# EAGLE schematic systems-controller (EAGLE 7.6.0)

## Sheet 1 of 4: Power Supply
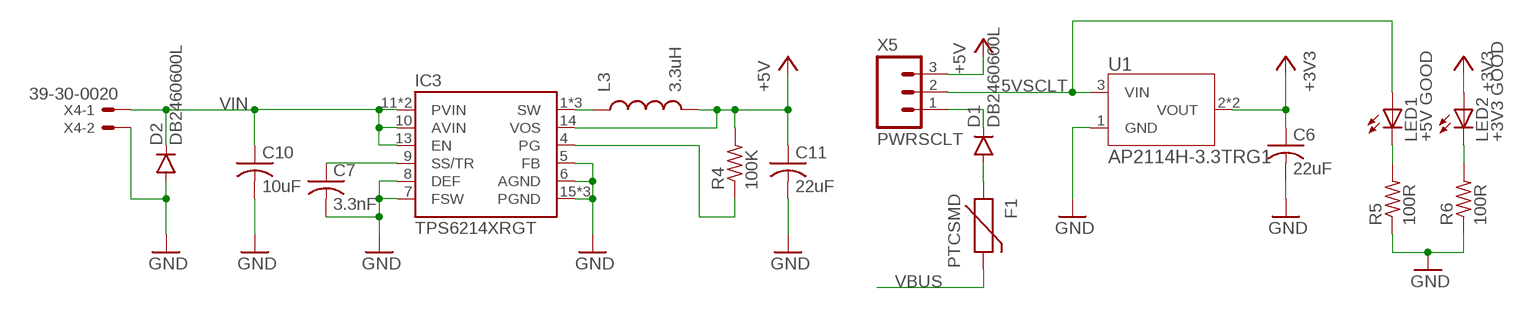
[diagram p0: schematic, sheet 1]

### Parts
C6  22uF  C-USC0805K  [C0805K]
C7  3.3nF  C-USC0603K  [C0603K]
C10  10uF  C-USC0805K  [C0805K]
C11  22uF  C-USC0805K  [C0805K]
D1  DB2460600L  DIODESOD128  [SOD-128]
D2  DB2460600L  DIODESOD128  [SOD-128]
F1  PTCSMD  [PTC-1206]
IC3  TPS6214XRGT  [16-VQFN]
L3  3.3uH  INDUCTOR-SRN5020  [SRN5020]
LED1  +5V GOOD  LEDSML0603  [SML0603]
LED2  +3V3 GOOD  LEDSML0603  [SML0603]
R4  100K  R-US_R0603  [R0603]
R5  100R  R-US_R0603  [R0603]
R6  100R  R-US_R0603  [R0603]
U1  AP2114H-3.3TRG1  [SOT-223]
X4  39-30-0020  [39-30-0020]
X5  PWRSCLT  M03PTH  [1X03]

### Nets
5VSCLT: LED1.A U1.3(VIN) X5.2
+3V3: C6.1 LED2.A U1.2(VOUT) U1.4(VOUT) ; also sheet 2
+5V: C11.1 IC3.14(VOS) L3.2 R4.2 X5.3 ; also sheet 3
GND: C6.2 C7.2 C10.2 C11.2 D2.A IC3.5(FB) IC3.6(AGND) IC3.7(FSW) IC3.8(DEF) IC3.15(PGND) IC3.16(PGND) IC3.PAD(PGND) R5.1 R6.1 U1.1(GND) X4.2 ; also sheet 2,3,4
N$13: IC3.4(PG) R4.1
N$14: C7.1 IC3.9(SS/TR)
N$16: D1.C X5.1
N$17: IC3.1(SW) IC3.2(SW) IC3.3(SW) L3.1
N$20: D1.A F1.1
N$23: LED1.C R5.2
N$24: LED2.C R6.2
VBUS: F1.2 ; also sheet 2
VIN: C10.1 D2.C IC3.10(AVIN) IC3.11(PVIN) IC3.12(PVIN) IC3.13(EN) X4.1 ; also sheet 3

## Sheet 2 of 4: Microcontroller
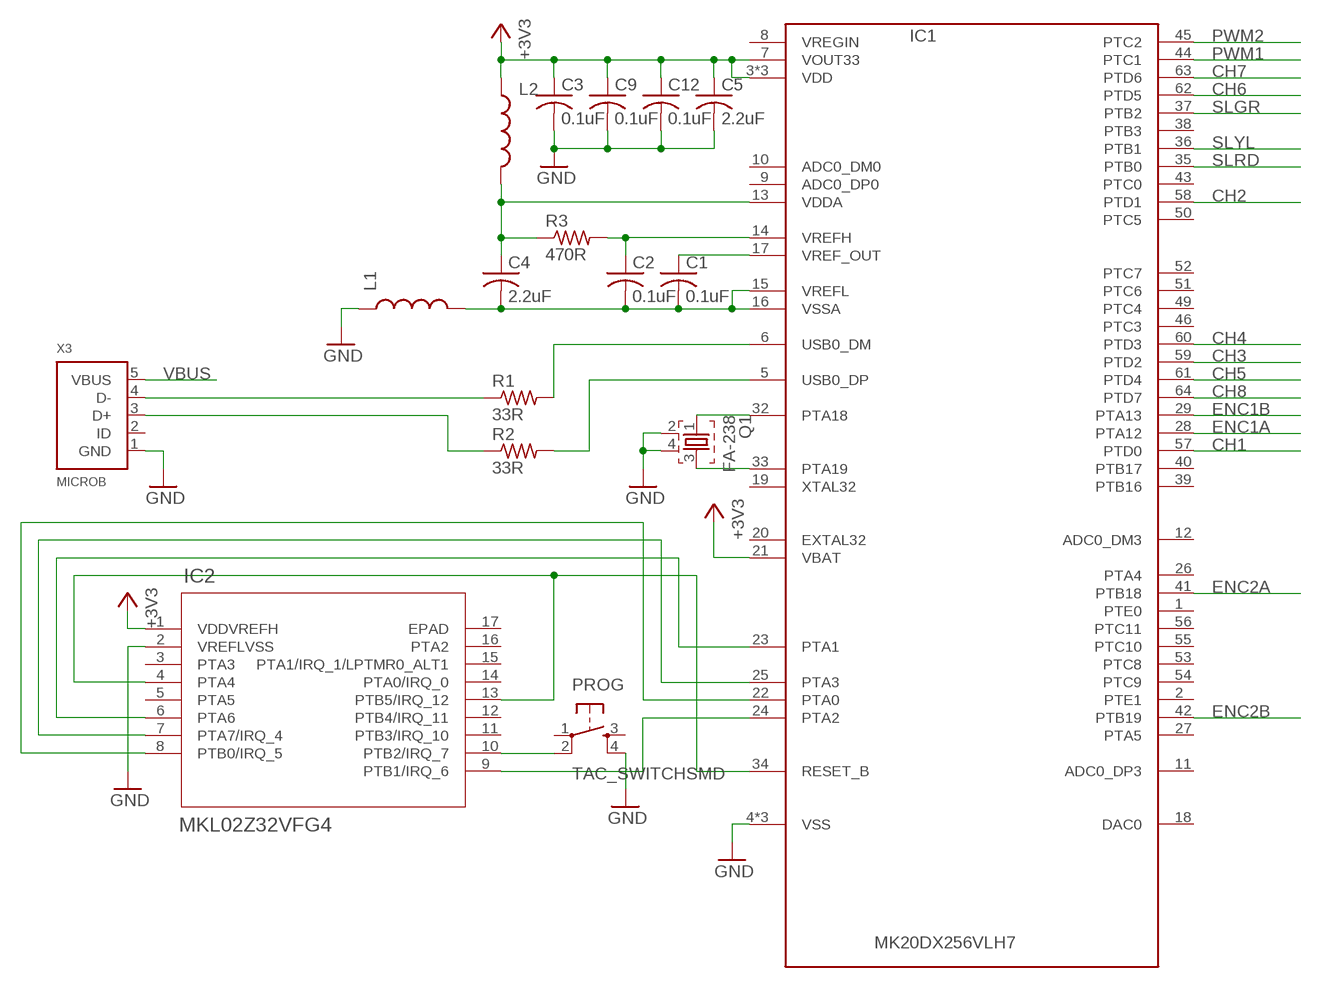
[diagram p1: schematic, sheet 2]

### Parts
C1  0.1uF  C-USC0603K  [C0603K]
C2  0.1uF  C-USC0603K  [C0603K]
C3  0.1uF  C-USC0603K  [C0603K]
C4  2.2uF  C-USC0603K  [C0603K]
C5  2.2uF  C-USC0603K  [C0603K]
C9  0.1uF  C-USC0603K  [C0603K]
C12  0.1uF  C-USC0603K  [C0603K]
IC1  MK20DX256VLH7  [MK20DX256VLH7]
IC2  MKL02Z32VFG4  [QFN-16_3X3X0.65]
L1  INDUCTOR30OHM,1.8A  [0603]
L2  INDUCTOR30OHM,1.8A  [0603]
PROG  TAC_SWITCHSMD  [TACTILE-SWITCH-SMD]
Q1  FA-238  [FA-238]
R1  33R  R-US_R0603  [R0603]
R2  33R  R-US_R0603  [R0603]
R3  470R  R-US_R0603  [R0603]
X3  MICROB  [10118192]

### Nets
+3V3: C3.1 C5.1 C9.1 C12.1 IC1.3(VDD) IC1.7(VOUT33) IC1.21(VBAT) IC1.30(VDD) IC1.48(VDD) IC2.1(VDDVREFH) L2.1 ; also sheet 1
CH1: IC1.57(PTD0) ; also sheet 3
CH2: IC1.58(PTD1) ; also sheet 3
CH3: IC1.59(PTD2) ; also sheet 3
CH4: IC1.60(PTD3) ; also sheet 3
CH5: IC1.61(PTD4) ; also sheet 3
CH6: IC1.62(PTD5) ; also sheet 3
CH7: IC1.63(PTD6) ; also sheet 3
CH8: IC1.64(PTD7) ; also sheet 3
ENC1A: IC1.28(PTA12) ; also sheet 3
ENC1B: IC1.29(PTA13) ; also sheet 3
ENC2A: IC1.41(PTB18) ; also sheet 3
ENC2B: IC1.42(PTB19) ; also sheet 3
GND: C3.2 C5.2 C9.2 C12.2 IC1.4(VSS) IC1.31(VSS) IC1.47(VSS) IC2.2(VREFLVSS) L1.1 PROG.4 Q1.2 Q1.4 X3.1(GND) ; also sheet 1,3,4
N$1: IC1.25(PTA3) IC2.7(PTA7/IRQ_4)
N$2: IC1.22(PTA0) IC2.8(PTB0/IRQ_5)
N$3: IC1.24(PTA2) IC2.9(PTB1/IRQ_6)
N$4: IC1.23(PTA1) IC2.6(PTA6)
N$5: IC1.34(RESET_B) IC2.4(PTA4) IC2.13(PTB5/IRQ_12)
N$6: R1.1 X3.4(D-)
N$7: IC1.6(USB0_DM) R1.2
N$8: R2.1 X3.3(D+)
N$9: IC1.5(USB0_DP) R2.2
N$10: IC1.32(PTA18) Q1.1
N$11: IC1.33(PTA19) Q1.3
N$12: C1.2 C2.2 C4.2 IC1.15(VREFL) IC1.16(VSSA) L1.2
N$15: C1.1 IC1.17(VREF_OUT)
N$18: C2.1 IC1.14(VREFH) R3.2
N$21: C4.1 IC1.13(VDDA) L2.2 R3.1
N$22: IC2.10(PTB2/IRQ_7) PROG.2
PWM1: IC1.44(PTC1) ; also sheet 3
PWM2: IC1.45(PTC2) ; also sheet 3
SLGR: IC1.37(PTB2) ; also sheet 4
SLRD: IC1.35(PTB0) ; also sheet 4
SLYL: IC1.36(PTB1) ; also sheet 4
VBUS: X3.5(VBUS) ; also sheet 1
Unconnected: IC1.1(PTE0) IC1.2(PTE1) IC1.8(VREGIN) IC1.9(ADC0_DP0) IC1.10(ADC0_DM0) IC1.11(ADC0_DP3) IC1.12(ADC0_DM3) IC1.18(DAC0) IC1.19(XTAL32) IC1.20(EXTAL32) IC1.26(PTA4) IC1.27(PTA5) IC1.38(PTB3) IC1.39(PTB16) IC1.40(PTB17) IC1.43(PTC0) IC1.46(PTC3) IC1.49(PTC4) IC1.50(PTC5) IC1.51(PTC6) IC1.52(PTC7) IC1.53(PTC8) IC1.54(PTC9) IC1.55(PTC10) IC1.56(PTC11) IC2.3(PTA3) IC2.5(PTA5) IC2.11(PTB3/IRQ_10) IC2.12(PTB4/IRQ_11) IC2.14(PTA0/IRQ_0) IC2.15(PTA1/IRQ_1/LPTMR0_ALT1) IC2.16(PTA2) IC2.17(EPAD) PROG.1 PROG.3 X3.2(ID)

## Sheet 3 of 4: External Connections
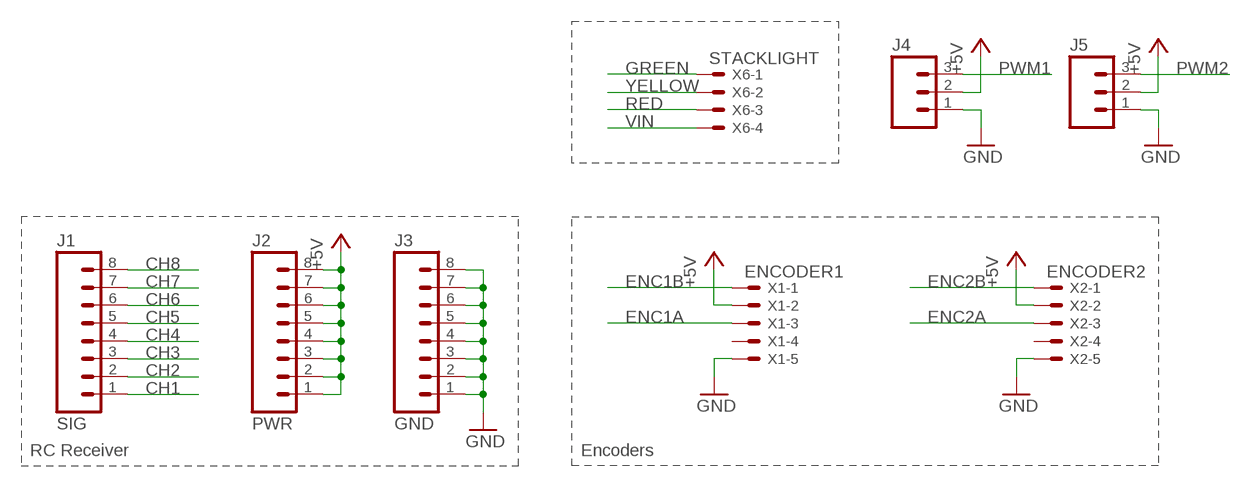
[diagram p2: schematic, sheet 3]

### Parts
J1  SIG  M08  [1X08_ROUND]
J2  PWR  M08  [1X08_ROUND]
J3  GND  M08  [1X08_ROUND]
J4  M03PTH  [1X03]
J5  M03PTH  [1X03]
X1  ENCODER1  C-GRID-05-70553  [70553-05]
X2  ENCODER2  C-GRID-05-70553  [70553-05]
X6  STACKLIGHT  C-GRID-04-70553  [70553-04]

### Nets
+5V: J2.1 J2.2 J2.3 J2.4 J2.5 J2.6 J2.7 J2.8 J4.2 J5.2 X1.2 X2.2 ; also sheet 1
CH1: J1.1 ; also sheet 2
CH2: J1.2 ; also sheet 2
CH3: J1.3 ; also sheet 2
CH4: J1.4 ; also sheet 2
CH5: J1.5 ; also sheet 2
CH6: J1.6 ; also sheet 2
CH7: J1.7 ; also sheet 2
CH8: J1.8 ; also sheet 2
ENC1A: X1.3 ; also sheet 2
ENC1B: X1.1 ; also sheet 2
ENC2A: X2.3 ; also sheet 2
ENC2B: X2.1 ; also sheet 2
GND: J3.1 J3.2 J3.3 J3.4 J3.5 J3.6 J3.7 J3.8 J4.1 J5.1 X1.5 X2.5 ; also sheet 1,2,4
GREEN: X6.1 ; also sheet 4
PWM1: J4.3 ; also sheet 2
PWM2: J5.3 ; also sheet 2
RED: X6.3 ; also sheet 4
VIN: X6.4 ; also sheet 1
YELLOW: X6.2 ; also sheet 4
Unconnected: X1.4 X2.4

### Notes on the sheet
- RC Receiver | Encoders

## Sheet 4 of 4: Stack Light FETs
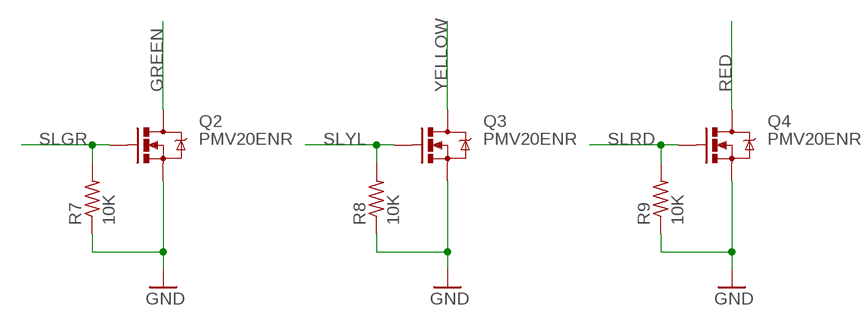
[diagram p3: schematic, sheet 4]

### Parts
Q2  PMV20ENR  MOSFET-NCHANNELAO3404A  [SOT23-3]
Q3  PMV20ENR  MOSFET-NCHANNELAO3404A  [SOT23-3]
Q4  PMV20ENR  MOSFET-NCHANNELAO3404A  [SOT23-3]
R7  10K  R-US_R0603  [R0603]
R8  10K  R-US_R0603  [R0603]
R9  10K  R-US_R0603  [R0603]

### Nets
GND: Q2.2(S) Q3.2(S) Q4.2(S) R7.1 R8.1 R9.1 ; also sheet 1,2,3
GREEN: Q2.3(D) ; also sheet 3
RED: Q4.3(D) ; also sheet 3
SLGR: Q2.1(G) R7.2 ; also sheet 2
SLRD: Q4.1(G) R9.2 ; also sheet 2
SLYL: Q3.1(G) R8.2 ; also sheet 2
YELLOW: Q3.3(D) ; also sheet 3

## Library data of the parts
C1-C7 C9-C12 = resistor:C-US: CAPACITOR, American symbol
D1 D2 = SparkFun-DiscreteSemi:DIODE: Diode These are standard reverse protection diodes and small signal diodes. SMA package can handle up to about 1A. SOD-323 can handle about 200mA. What the SOD-323 package when ordering, there are some mfgs out there that are 5-pin packages.
F1 = SparkFun-PowerIC:PTC: Resettable Fuse PTC Resettable Fuse. Spark Fun Electronics SKU : COM-08357; PROD_ID: RES-11150
IC1 = TeensyCustom:MK20DX256VLH7: Teensy 3.1 Processing Unit - MK20DX256VLH7 ARM Cortex M4 Datasheet: K20P64M50SF0.pdf <http://cache.freescale.com/files/32bit/doc/data_sheet/K20P64M50SF0.pdf>
IC2 = TeensyCustom:MKL02Z32VFG4; CPU: ARM Cortex-M0+; FLASHKB: 32; MANUFACTURER_PART_NUMBER: mkl02z32vfg4; MAXFREQUENCY: 48; PINCOUNT: 16; SRAMKB: 4; VENDOR: FREESCALE
IC3 = texas:TPS6214X: TPS6214x 3-V to 17-V 2-A Step-Down Converter in 3 × 3 QFN Package Source: TPS6214x Datasheet <http://www.ti.com/lit/ds/symlink/tps62140.pdf>
J1-J3 = SparkFun-Connectors:M08: Header 8 Standard 8-pin 0.1" header. Use with straight break away headers (SKU : PRT-00116), right angle break away headers (PRT-00553), swiss pins (PRT-00743), machine pins (PRT-00117), and female headers (PRT-00115).; PROD_ID: CONN-08437
J4 J5 X5 = SparkFun-Connectors:M03: Header 3 Standard 3-pin 0.1" header. Use with straight break away headers (SKU : PRT-00116), right angle break away headers (PRT-00553), swiss pins (PRT-00743), machine pins (PRT-00117), and female headers (PRT-00115). Molex polarized connector foot print use with SKU : PRT-08232 with associated crimp pins and housings.
L1 L2 = SparkFun-Passives:INDUCTOR: Inductors Basic Inductor/Choke - 0603 and 1206. Footprints are not proven and vary greatly between part numbers. INDUCTOR POWER 3.3UH 4.0A SMD 0.197" L x 0.197" W x 0.177" H (5.00mm x 5.00mm x 4.50mm); PROD_ID: RES-07859
L3 = bourns:INDUCTOR-: Inductor
LED1 LED2 = led:LED: LED OSRAM: - CHIPLED LG R971, LG N971, LY N971, LG Q971, LY Q971, LO R971, LY R971 LH N974, LH R974 LS Q976, LO Q976, LY Q976 LO Q996 - Hyper CHIPLED LW Q18S LB Q993, LB Q99A, LB R99A - SideLED LS A670, LO A670, LY A670, LG A670, LP A670 LB A673, LV A673, LT A673, LW A673 LH A674 LY A675 LS A676, LA A676, LO A676, LY A676, LW A676 LS A679, LY A679, LG A679 - Hyper Micro SIDELED® LS Y876, LA Y876, LO Y876, LY Y876 LT Y87S - SmartLED LW L88C, LW L88S LB L89C, LB L89S, LG L890 LS L89K, LO L89K, LY L89K LS L896, LA L896, LO L896, LY L896 - TOPLED LS T670, LO T670, LY T670, LG T670, LP T670 LSG T670, LSP T670, LSY T670, LOP T670, LYG T670 LG T671, LOG T671, LSG T671 LB T673, LV T673, LT T673, LW T673 LH T674 LS T676, LA T676, LO T676, LY T676, LB T676, LH T676, LSB T676, LW T676 LB T67C, LV T67C, LT T67C, LS T67K, LO T67K, LY T67K, LW E67C LS E67B, LA E67B, LO E67B, LY E67B, LB E67C, LV E67C, LT E67C LW T67C LS T679, LY T679, LG T679 LS T770, LO T770, LY T770, LG T770, LP T770 LB T773, LV T773, LT T773, LW T773 LH T774 LS E675, LA E675, LY E675, LS T675 LS T776, LA T776, LO T776, LY T776, LB T776 LHGB T686 LT T68C, LB T68C - Hyper Mini TOPLED® LB M676 - Mini TOPLED Santana® LG M470 LS M47K, LO M47K, LY M47K Source: http://www.osram.convergy.de LUXEON: - LUMILED® LXK2-PW12-R00, LXK2-PW12-S00, LXK2-PW14-U00, LXK2-PW14-V00 LXK2-PM12-R00, LXK2-PM12-S00, LXK2-PM14-U00 LXK2-PE12-Q00, LXK2-PE12-R00, LXK2-PE12-S00, LXK2-PE14-T00, LXK2-PE14-U00 LXK2-PB12-K00, LXK2-PB12-L00, LXK2-PB12-M00, LXK2-PB14-N00, LXK2-PB14-P00, LXK2-PB14-Q00 LXK2-PR12-L00, LXK2-PR12-M00, LXK2-PR14-Q00, LXK2-PR14-R00 LXK2-PD12-Q00, LXK2-PD12-R00, LXK2-PD12-S00 LXK2-PH12-R00, LXK2-PH12-S00 LXK2-PL12-P00, LXK2-PL12-Q00, LXK2-PL12-R00 Source: www.luxeon.com KINGBRIGHT: KA-3528ASYC Source: www.kingbright.com
PROG = SparkFun-Retired:TAC_SWITCH: Momentary Switch Button commonly used for reset or general input. Spark Fun Electronics SKU : COM-00097 SMT- SWCH-08247; PROD_ID: SWCH-08247
Q1 = crystal:FA-: MHz RANGE CRYSTAL UNIT Source: Epson Toyocom
Q2-Q4 = SparkFun-DiscreteSemi:MOSFET-NCHANNEL: Common NMOSFET Parts MFG P/N Store ID Prod ID FDD8780 TRANS-09984 SI7820DN TRANS-11055 FDS6630A IC-08089 2N7002PW TRANS-11151 FQP30N06L COM-10213 TRANS-10060 BSS123LT1G TRANS-08345 BSS138 TRANS-00830 BS170 2N7000; PROD_ID: TRAN-12988
R1-R9 = resistor:R-US_: RESISTOR, American symbol
U1 = diodes-inc:AP2114H-3.3TRG1; MANUFACTURER_PART_NUMBER: ap2114h-3.3trg1; VENDOR: DIODESINC_2
X1 X2 = con-molex:C-GRID-05: CONNECTOR wire to board 2.54 mm (0.100") pitch header; OC_FARNELL: unknown; OC_NEWARK: unknown
X3 = con-amphenol:MICROB: USB - micro B Amphenol FCI 10118192-0001LF
X4 = con-molex:39-30-0020
X6 = con-molex:C-GRID-04: CONNECTOR wire to board 2.54 mm (0.100") pitch header; OC_FARNELL: unknown; OC_NEWARK: unknown